# Altium schematic sheet PWR612A_SH2.SchDoc: TPS23861 Base Board without  VPWR
size 558 x 431 mm; Engineer: Trevor; Revision: A; Name: Trevor
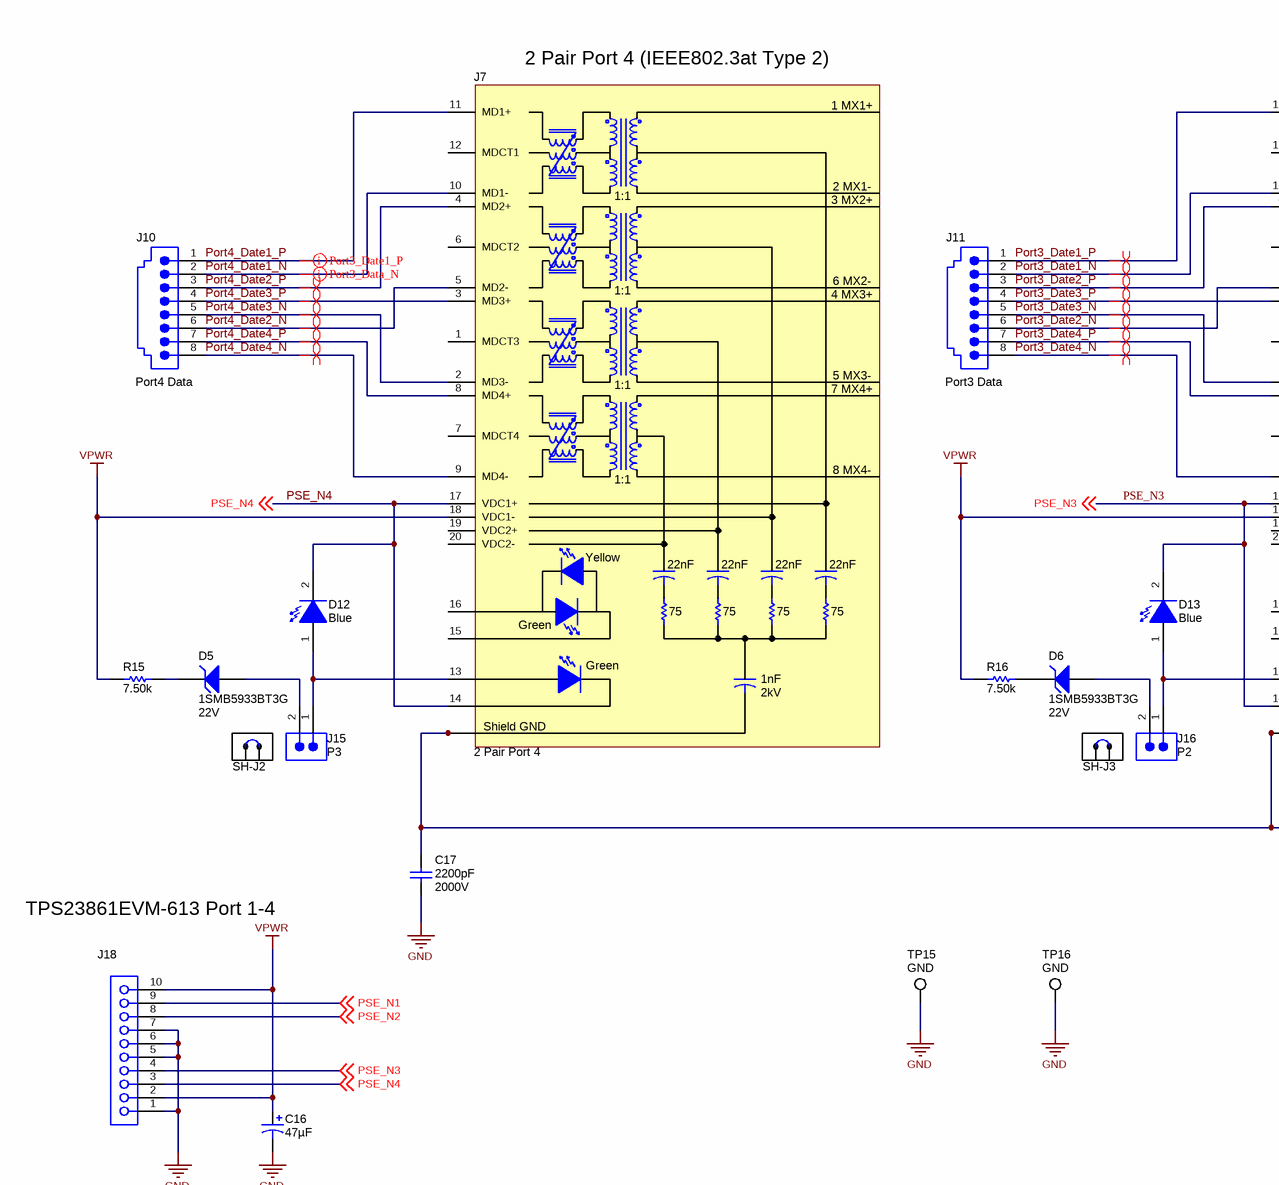
[diagram p0: PWR612A_SH2.SchDoc, top left]
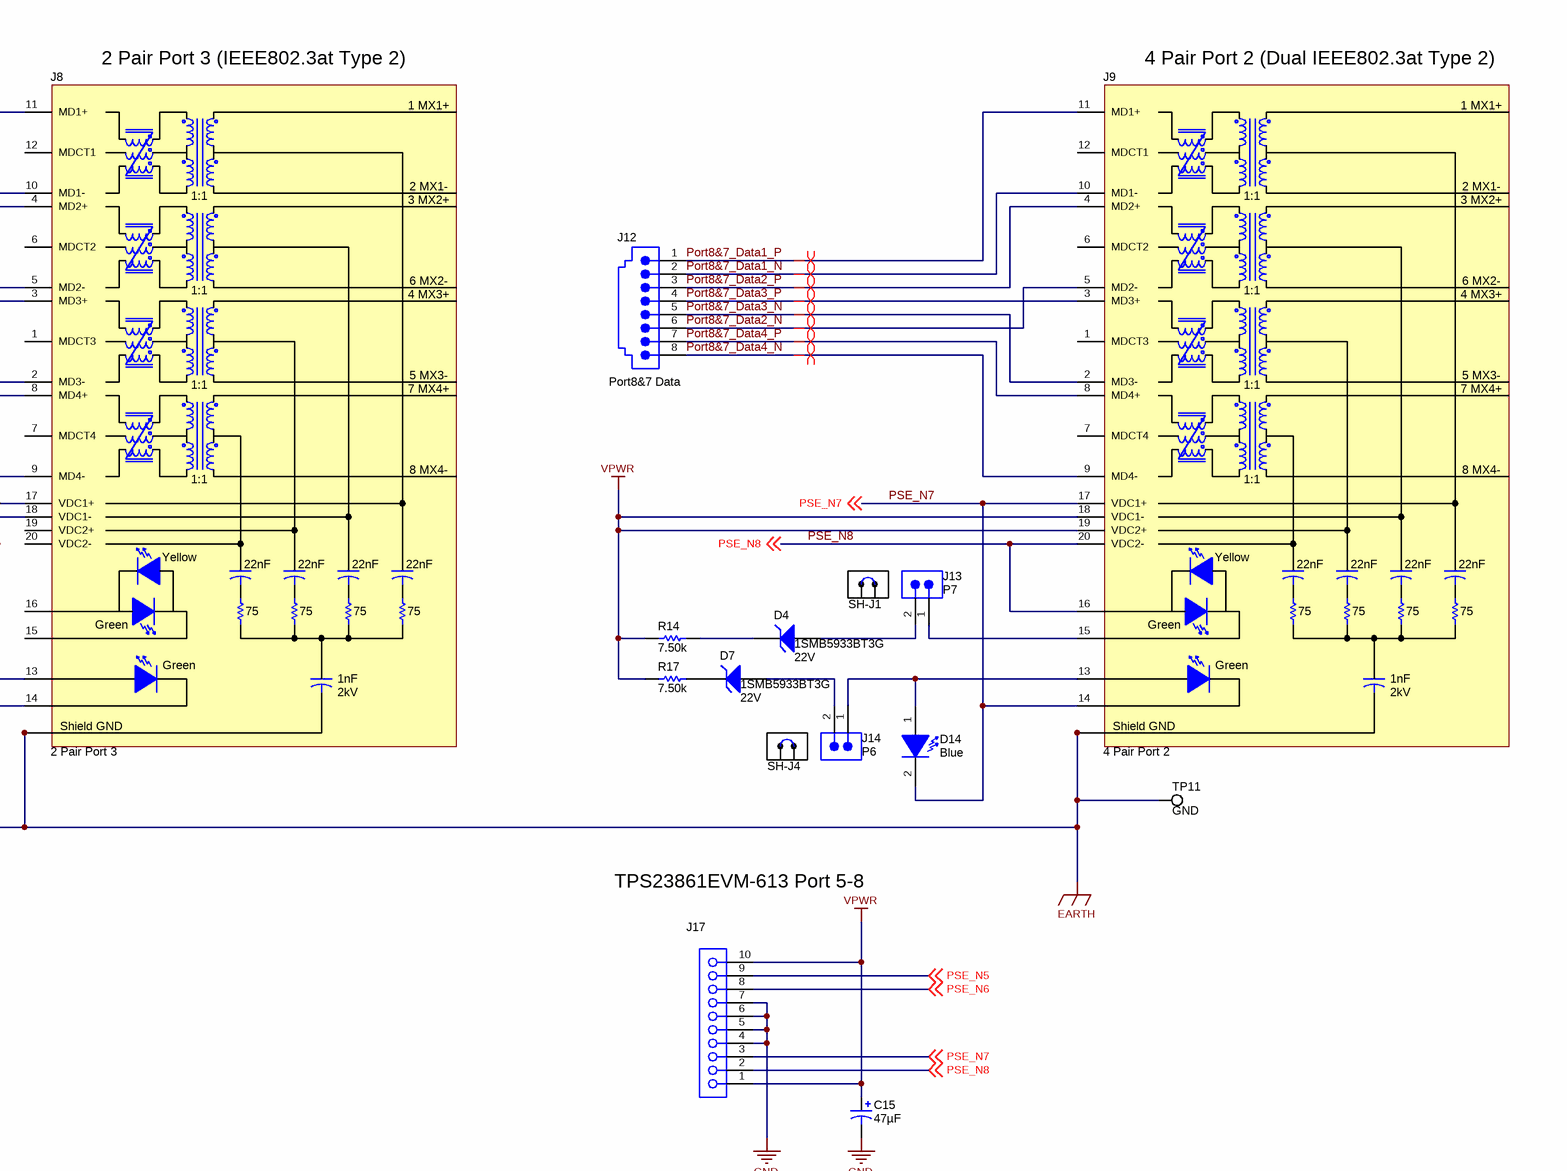
[diagram p1: PWR612A_SH2.SchDoc, top right]
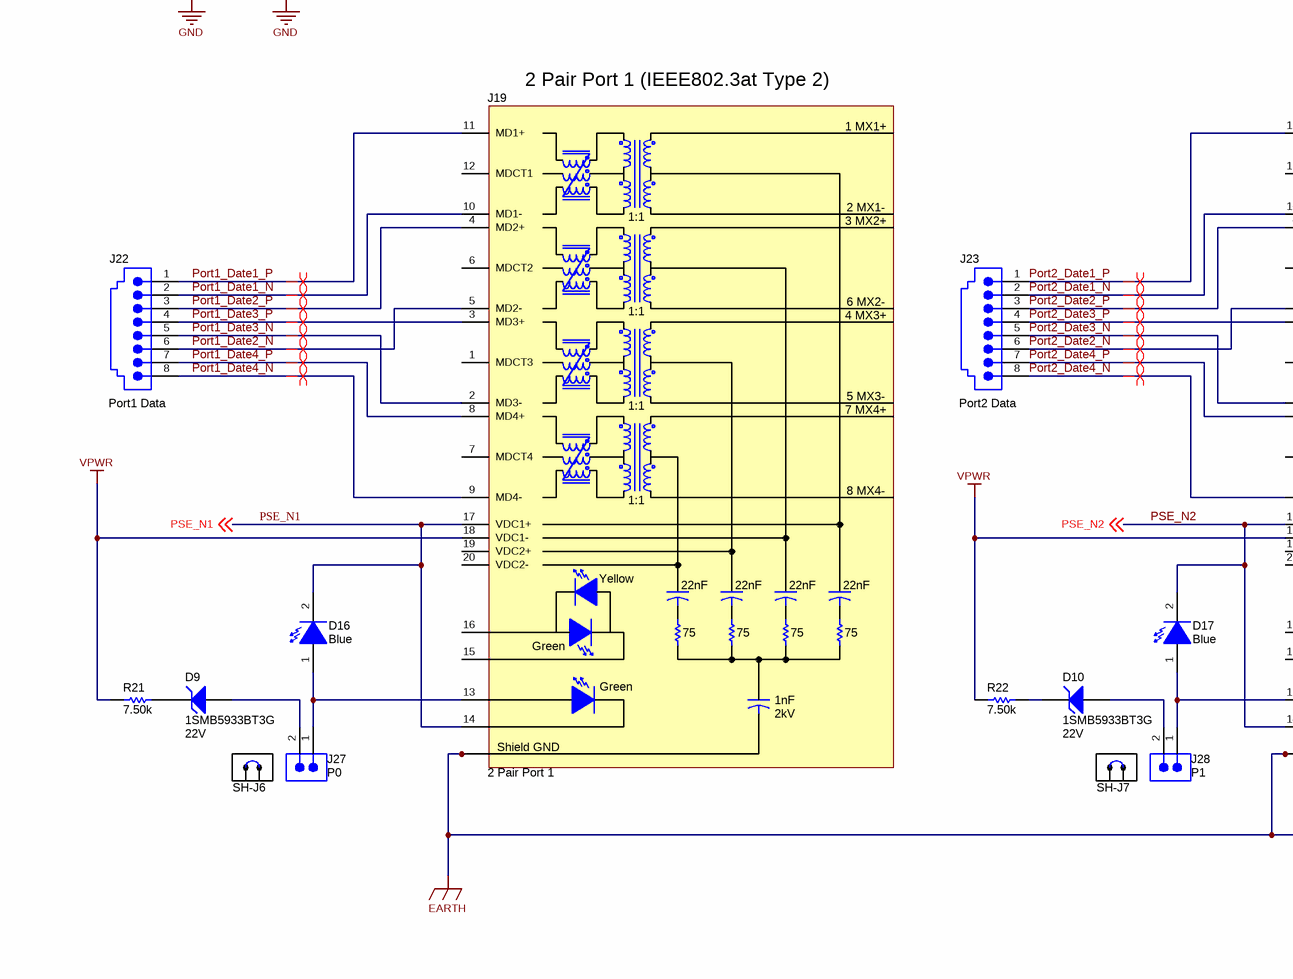
[diagram p2: PWR612A_SH2.SchDoc, bottom left]
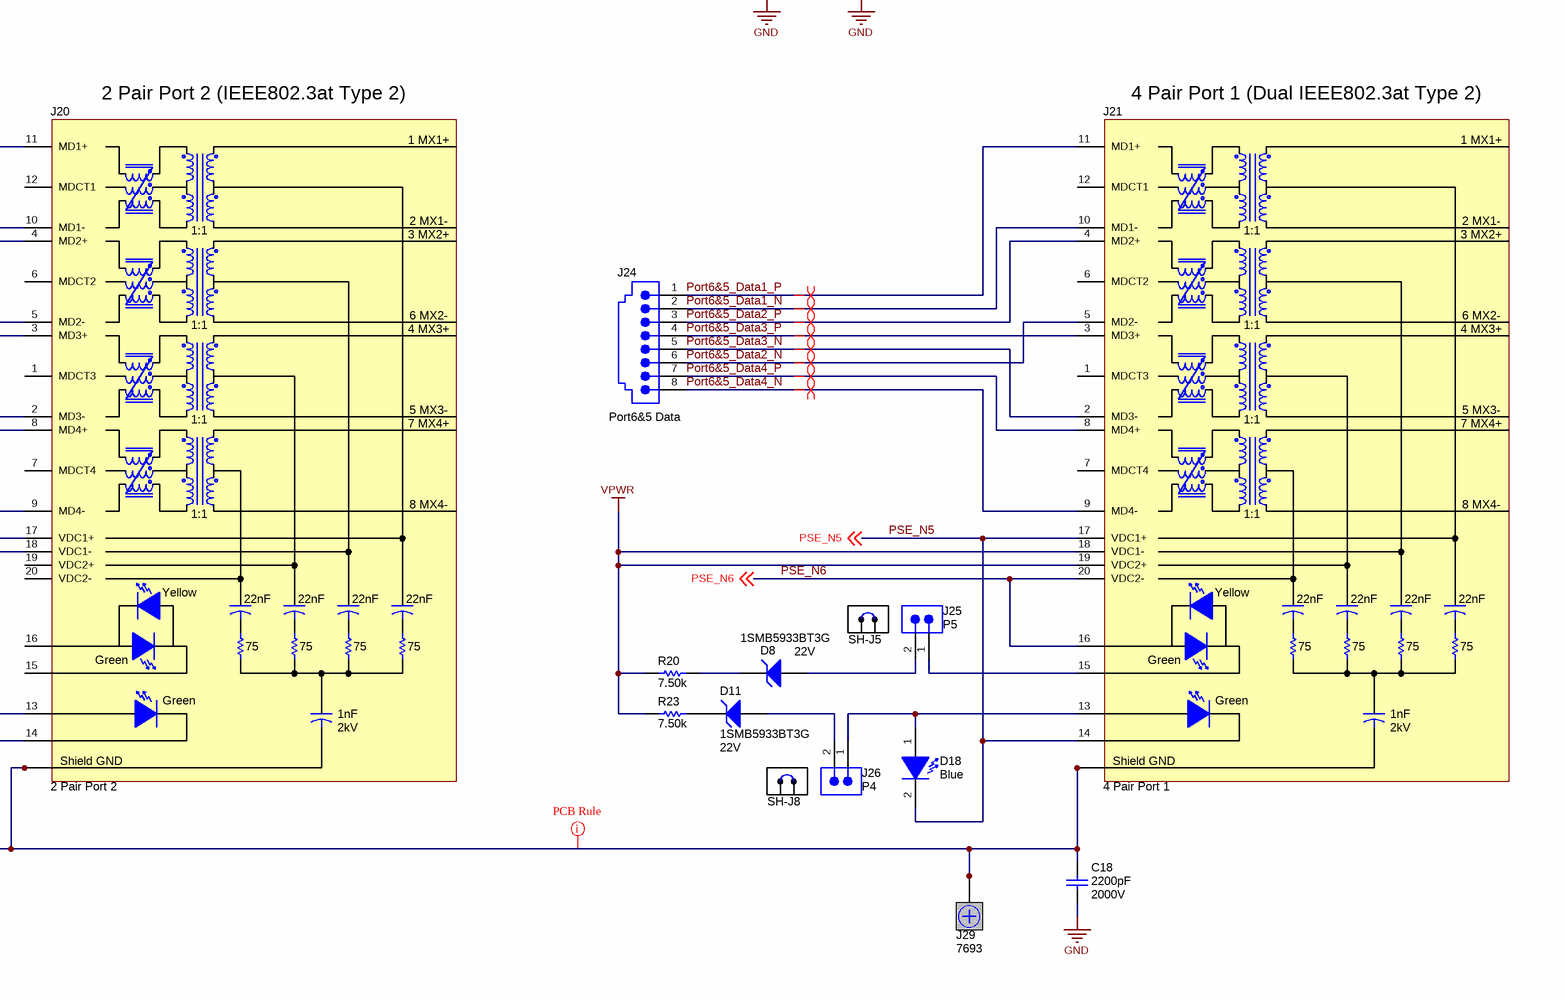
[diagram p3: PWR612A_SH2.SchDoc, bottom right]

## Parts
C15  ValueDisplayed: 47µF  [SM_RADIAL_H13]  (hidden comment: EEV-FK2A470Q)
C16  ValueDisplayed: 47µF  [SM_RADIAL_H13]  (hidden comment: EEV-FK2A470Q)
C17  ValueDisplayed: 2200pF  Value2: 2000V  [1812]  (hidden comment: C4532X7R3D222K)
C18  ValueDisplayed: 2200pF  Value2: 2000V  [1812]  (hidden comment: C4532X7R3D222K)
D4  1SMB5933BT3G  value 22V  [SMB]
D5  1SMB5933BT3G  value 22V  [SMB]
D6  1SMB5933BT3G  value 22V  [SMB]
D7  1SMB5933BT3G  value 22V  [SMB]
D8  1SMB5933BT3G  value 22V  [SMB]
D9  1SMB5933BT3G  value 22V  [SMB]
D10  1SMB5933BT3G  value 22V  [SMB]
D11  1SMB5933BT3G  value 22V  [SMB]
D12  value Blue  [LB Q39G_BLUE]  (hidden comment: LB Q39G-L2N2-35-1)
D13  value Blue  [LB Q39G_BLUE]  (hidden comment: LB Q39G-L2N2-35-1)
D14  value Blue  [LB Q39G_BLUE]  (hidden comment: LB Q39G-L2N2-35-1)
D16  value Blue  [LB Q39G_BLUE]  (hidden comment: LB Q39G-L2N2-35-1)
D17  value Blue  [LB Q39G_BLUE]  (hidden comment: LB Q39G-L2N2-35-1)
D18  value Blue  [LB Q39G_BLUE]  (hidden comment: LB Q39G-L2N2-35-1)
J7  2 Pair Port 4  [JK0-0177NL]
J8  2 Pair Port 3  [JK0-0177NL]
J9  4 Pair Port 2  [JK0-0177NL]
J10  SS-7188V-A-NF  [CONN_SS-7188V-A-NF]  (value not drawn)
J11  SS-7188V-A-NF  [CONN_SS-7188V-A-NF]  (value not drawn)
J12  SS-7188V-A-NF  [CONN_SS-7188V-A-NF]  (value not drawn)
J13  P7  [TSW-102-07-G-S]
J14  P6  [TSW-102-07-G-S]
J15  P3  [TSW-102-07-G-S]
J16  P2  [TSW-102-07-G-S]
J17  Port8&7&6&5  [CONN_SSW-110-23-F-S]  (value not drawn)
J18  Port4&3&2&1  [CONN_SSW-110-23-F-S]  (value not drawn)
J19  2 Pair Port 1  [JK0-0177NL]
J20  2 Pair Port 2  [JK0-0177NL]
J21  4 Pair Port 1  [JK0-0177NL]
J22  SS-7188V-A-NF  [CONN_SS-7188V-A-NF]  (value not drawn)
J23  SS-7188V-A-NF  [CONN_SS-7188V-A-NF]  (value not drawn)
J24  SS-7188V-A-NF  [CONN_SS-7188V-A-NF]  (value not drawn)
J25  P5  [TSW-102-07-G-S]
J26  P4  [TSW-102-07-G-S]
J27  P0  [TSW-102-07-G-S]
J28  P1  [TSW-102-07-G-S]
J29  7693  [7693]
R14  value 7.50k  [1206]  (hidden comment: CRCW12067K50FKEA)
R15  value 7.50k  [1206]  (hidden comment: CRCW12067K50FKEA)
R16  value 7.50k  [1206]  (hidden comment: CRCW12067K50FKEA)
R17  value 7.50k  [1206]  (hidden comment: CRCW12067K50FKEA)
R20  value 7.50k  [1206]  (hidden comment: CRCW12067K50FKEA)
R21  value 7.50k  [1206]  (hidden comment: CRCW12067K50FKEA)
R22  value 7.50k  [1206]  (hidden comment: CRCW12067K50FKEA)
R23  value 7.50k  [1206]  (hidden comment: CRCW12067K50FKEA)
SH-J1  SPC02SYAN  [SPC02SYAN]  (value not drawn)
SH-J2  SPC02SYAN  [SPC02SYAN]  (value not drawn)
SH-J3  SPC02SYAN  [SPC02SYAN]  (value not drawn)
SH-J4  SPC02SYAN  [SPC02SYAN]  (value not drawn)
SH-J5  SPC02SYAN  [SPC02SYAN]  (value not drawn)
SH-J6  SPC02SYAN  [SPC02SYAN]  (value not drawn)
SH-J7  SPC02SYAN  [SPC02SYAN]  (value not drawn)
SH-J8  SPC02SYAN  [SPC02SYAN]  (value not drawn)
TP11  GND  [Testpoint_Keystone_Compact]
TP15  GND  [Testpoint_Keystone_Compact]
TP16  GND  [Testpoint_Keystone_Compact]

## Nets
EARTH: C17.1 C18.1 J7.21(Shield) J7.22(Shield) J8.21(Shield) J8.22(Shield) J9.21(Shield) J9.22(Shield) J19.21(Shield) J19.22(Shield) J20.21(Shield) J20.22(Shield) J21.21(Shield) J21.22(Shield) J29.1 J29.2 J29.3 J29.4 TP11.1
GND: C15.2(-) C16.2(-) C17.2 C18.2 J17.4 J17.5 J17.6 J17.7 J18.1 J18.5 J18.6 J18.7 TP15.1 TP16.1
VPWR: C15.1(+) C16.1(+) J7.18(VDC1-) J8.18(VDC1-) J9.18(VDC1-) J9.19(VDC2+) J17.1 J17.10 J18.2 J18.10 J19.18(VDC1-) J20.18(VDC1-) J21.18(VDC1-) J21.19(VDC2+) R14.1 R15.1 R16.1 R17.1 R20.1 R21.1 R22.1 R23.1
Port1_Date1_N: J19.10(MD1-) J22.2
Port1_Date1_P: J19.11(MD1+) J22.1
Port1_Date2_N: J19.5(MD2-) J22.6
Port1_Date2_P: J19.4(MD2+) J22.3
Port1_Date3_N: J19.2(MD3-) J22.5
Port1_Date3_P: J19.3(MD3+) J22.4
Port1_Date4_N: J19.9(MD4-) J22.8
Port1_Date4_P: J19.8(MD4+) J22.7
Port2_Date1_N: J20.10(MD1-) J23.2
Port2_Date1_P: J20.11(MD1+) J23.1
Port2_Date2_N: J20.5(MD2-) J23.6
Port2_Date2_P: J20.4(MD2+) J23.3
Port2_Date3_N: J20.2(MD3-) J23.5
Port2_Date3_P: J20.3(MD3+) J23.4
Port2_Date4_N: J20.9(MD4-) J23.8
Port2_Date4_P: J20.8(MD4+) J23.7
Port3_Date1_N: J8.10(MD1-) J11.2
Port3_Date1_P: J8.11(MD1+) J11.1
Port3_Date2_N: J8.5(MD2-) J11.6
Port3_Date2_P: J8.4(MD2+) J11.3
Port3_Date3_N: J8.2(MD3-) J11.5
Port3_Date3_P: J8.3(MD3+) J11.4
Port3_Date4_N: J8.9(MD4-) J11.8
Port3_Date4_P: J8.8(MD4+) J11.7
Port4_Date1_N: J7.10(MD1-) J10.2
Port4_Date1_P: J7.11(MD1+) J10.1
Port4_Date2_N: J7.5(MD2-) J10.6
Port4_Date2_P: J7.4(MD2+) J10.3
Port4_Date3_N: J7.2(MD3-) J10.5
Port4_Date3_P: J7.3(MD3+) J10.4
Port4_Date4_N: J7.9(MD4-) J10.8
Port4_Date4_P: J7.8(MD4+) J10.7
Port6&5_Data1_N: J21.10(MD1-) J24.2
Port6&5_Data1_P: J21.11(MD1+) J24.1
Port6&5_Data2_N: J21.5(MD2-) J24.6
Port6&5_Data2_P: J21.4(MD2+) J24.3
Port6&5_Data3_N: J21.2(MD3-) J24.5
Port6&5_Data3_P: J21.3(MD3+) J24.4
Port6&5_Data4_N: J21.9(MD4-) J24.8
Port6&5_Data4_P: J21.8(MD4+) J24.7
Port8&7_Data1_N: J9.10(MD1-) J12.2
Port8&7_Data1_P: J9.11(MD1+) J12.1
Port8&7_Data2_N: J9.5(MD2-) J12.6
Port8&7_Data2_P: J9.4(MD2+) J12.3
Port8&7_Data3_N: J9.2(MD3-) J12.5
Port8&7_Data3_P: J9.3(MD3+) J12.4
Port8&7_Data4_N: J9.9(MD4-) J12.8
Port8&7_Data4_P: J9.8(MD4+) J12.7
PSE_N1: D16.2(K) J18.9 J19.14 J19.17(VDC1+) ; off-sheet PSE_N1
PSE_N2: D17.2(K) J18.8 J20.14 J20.17(VDC1+) ; off-sheet PSE_N2
PSE_N3: D13.2(K) J8.14 J8.17(VDC1+) J18.4 ; off-sheet PSE_N3
PSE_N4: D12.2(K) J7.14 J7.17(VDC1+) J18.3 ; off-sheet PSE_N4
PSE_N5: D18.2(K) J17.9 J21.14 J21.17(VDC1+) ; off-sheet PSE_N5
PSE_N6: J17.8 J21.16 J21.20(VDC2-) ; off-sheet PSE_N6
PSE_N7: D14.2(K) J9.14 J9.17(VDC1+) J17.3 ; off-sheet PSE_N7
PSE_N8: J9.16 J9.20(VDC2-) J17.2 ; off-sheet PSE_N8
NetD4_1: D4.1(K) R14.2
NetD4_2: D4.2(A) J13.2
NetD5_1: D5.1(K) R15.2
NetD5_2: D5.2(A) J15.2
NetD6_1: D6.1(K) R16.2
NetD6_2: D6.2(A) J16.2
NetD7_1: D7.1(K) R17.2
NetD7_2: D7.2(A) J14.2
NetD8_1: D8.1(K) R20.2
NetD8_2: D8.2(A) J25.2
NetD9_1: D9.1(K) R21.2
NetD9_2: D9.2(A) J27.2
NetD10_1: D10.1(K) R22.2
NetD10_2: D10.2(A) J28.2
NetD11_1: D11.1(K) R23.2
NetD11_2: D11.2(A) J26.2
NetD12_1: D12.1(A) J7.13 J15.1
NetD13_1: D13.1(A) J8.13 J16.1
NetD14_1: D14.1(A) J9.13 J14.1
NetD16_1: D16.1(A) J19.13 J27.1
NetD17_1: D17.1(A) J20.13 J28.1
NetD18_1: D18.1(A) J21.13 J26.1
NetJ9_15: J9.15 J13.1
NetJ21_15: J21.15 J25.1

Not connected (* = marked no-connect by the designer): J7 1(MDCT3) 6(MDCT2) 7(MDCT4) 12(MDCT1) 15 16 19(VDC2+) 20(VDC2-); J8 1(MDCT3) 6(MDCT2) 7(MDCT4) 12(MDCT1) 15 16 19(VDC2+) 20(VDC2-); J9 1(MDCT3) 6(MDCT2) 7(MDCT4) 12(MDCT1); J19 1(MDCT3) 6(MDCT2) 7(MDCT4) 12(MDCT1) 15 16 19(VDC2+) 20(VDC2-); J20 1(MDCT3) 6(MDCT2) 7(MDCT4) 12(MDCT1) 15 16 19(VDC2+) 20(VDC2-); J21 1(MDCT3) 6(MDCT2) 7(MDCT4) 12(MDCT1)

## Layout directives
differential pair: Port1_Date1_N, Port1_Date1_P, Port1_Date2_N, Port1_Date2_P, Port1_Date3_N, Port1_Date3_P, Port1_Date4_N, Port1_Date4_P, Port2_Date1_N, Port2_Date1_P, Port2_Date2_N, Port2_Date2_P, Port2_Date3_N, Port2_Date3_P, Port2_Date4_N, Port2_Date4_P, Port3_Date1_N, Port3_Date1_P, Port3_Date2_N, Port3_Date2_P, Port3_Date3_N, Port3_Date3_P, Port3_Date4_N, Port3_Date4_P, Port4_Date1_N, Port4_Date1_P, Port4_Date2_N, Port4_Date2_P, Port4_Date3_N, Port4_Date3_P, Port4_Date4_N, Port4_Date4_P, Port6&5_Data1_N, Port6&5_Data1_P, Port6&5_Data2_N, Port6&5_Data2_P, Port6&5_Data3_N, Port6&5_Data3_P, Port6&5_Data4_N, Port6&5_Data4_P, Port8&7_Data1_N, Port8&7_Data1_P, Port8&7_Data2_N, Port8&7_Data2_P, Port8&7_Data3_N, Port8&7_Data3_P, Port8&7_Data4_N, Port8&7_Data4_P
rule Undefined; rule Clearance Constraint [Clearance = 39mil]: EARTH

## Notes on the sheet
- 2 Pair Port 4 (IEEE802.3at Type 2)
- 2 Pair Port 3 (IEEE802.3at Type 2)
- (near J9) 4 Pair Port 2 (Dual IEEE802.3at Type 2)
- (near J10) Port4 Data
- (near J11) Port3 Data
- (near J12) Port8&7 Data
- TPS23861EVM-613 Port 1-4
- TPS23861EVM-613 Port 5-8
- (near J19) 2 Pair Port 1 (IEEE802.3at Type 2)
- 2 Pair Port 2 (IEEE802.3at Type 2)
- (near J21) 4 Pair Port 1 (Dual IEEE802.3at Type 2)
- (near J22) Port1 Data
- (near J23) Port2 Data
- (near J24) Port6&5 Data
- Drawn By:
- SVN Rev:
- Number:
- Rev:
- Sheet Title:
- File:
- Project Title:
- Designed for:
- Assembly Variant:
- Mod. Date:
- Sheet:
- Size:
- of
- C
- http://www.ti.com
- Texas Instruments and/or its licensors do not warrant the accuracy or completeness of this specification or any information contained therein. Texas Instruments and/or its licensors do not warrant that this design will meet the specifications, will be suitable for your application or fit for any particular purpose, or will operate in an implementation. Texas Instruments and/or its licensors do not warrant that the design is production worthy. You should completely validate and test your design implementation to confirm the system functionality for your application.
- Engineer:
- Contact:
- © Texas Instruments
- (in symbol JK0-0177NL) 1 MX1+; 2 MX1-; 1:1; 3 MX2+; 6 MX2-; 4 MX3+; 5 MX3-; 7 MX4+; 8 MX4-; Yellow; 22nF; 75; Green; 1nF; 2kV; Shield GND

## Library data of the parts
C15 C16 = EEV-FK2A470Q: CAP, AL, 47uF, 100V, +/-20%, 0.32 ohm, SMD; Manufacturer: Panasonic; Polarized: Y; CompType: Capacitor; U/M: EA; Cap_F: 0.000047; Tolerance_%: 20; VDC_V: 100; ESR_Ohm: 0.32; IRMS_A: 0.5; TaMin_C: -55; TaMax_C: 105; Cap_Case: H13; SymbolVersion: 2008-07-09; Value: 47uF; PartNumber: EEV-FK2A470Q; PackageReference: SMT Radial H13; RoHS: Y; Value1: 0.32 ohm; Value2: 100V; MountType: SMT; Technology: AL; Series: FK; Publisher: Texas Instruments; LatestRevisionDate: 2013-05-15; ComponentLink1Description: Datasheet link; ComponentLink1URL: http://www.panasonic.com/industrial/components/pdf/smt_aec_050505.pdf; Supplier 1: Digi-Key; Supplier Part Number 1: PCE3497CT-ND; Supplier 2: Mouser; Supplier Part Number 2: 667-EEV-FK2A470Q; Supplier 3: Farnell; Supplier Part Number 3: 9696148
C17 C18 = C4532X7R3D222K: CAP, CERM, 2200pF, 2000V, +/-10%, X7R, 1812; Manufacturer: TDK; Polarized: N; CompType: Capacitor; U/M: EA; Cap_F: 0.0000000022; Tolerance_%: 10; Value1: Unknown; VDC_V: 2000; TaMin_C: -55; TaMax_C: 125; SymbolVersion: 2008-07-09; Value: 2200pF; PartNumber: C4532X7R3D222K; PackageReference: 1812; RoHS: Y; MountType: SMT; Technology: Ceramic; TempCo: X7R; Cap_Case: 1812; Published: 2008-06-19; Publisher: Texas Instruments; LatestRevisionDate: 2014-01-24; ComponentLink1Description: Datasheet link; ComponentLink1URL: http://www.tdk.co.jp/tefe02/e4142_c.pdf; Supplier 1: Digi-Key; Supplier Part Number 1: 445-2389-1-ND; Supplier 2: Farnell; Supplier Part Number 2: 1844458
D4-D11 = 1SMB5933BT3G: Diode, Zener, 22V, 550mW, SMB; Manufacturer: ON Semiconductor; U/M: EA; Power_W: 0.55; Vz_V: 22; Value1: 0.55W; RJA_CperW: 226; CompType: Zener; SymbolVersion: 2010-08-25; PartNumber: 1SMB5933BT3G; PackageReference: SMB; Vr_V: N/A; MountType: SMT; RoHS: Y; ComponentLink1Description: Datasheet link; ComponentLink1URL: http://www.onsemi.com/pub_link/Collateral/1SMB5913BT3-D.PDF; Published: 2008-10-08; Publisher: Texas Instruments; LatestRevisionDate: 2013-04-19; LatestRevisionNote: Updated Supplier Data; Supplier 1: Mouser; Supplier Part Number 1: 863-1SMB5933BT3G; Supplier 2: Farnell; Supplier Part Number 2: 1431175; Supplier 3: Newark; Supplier Part Number 3: 42K3098
D12-D14 D16-D18 = LB Q39G-L2N2-35-1: LED, Blue, SMD; Manufacturer: OSRAM; Vf_V: 2.85; Value2: 2.85V; Io_A: 0.15; Tjmax_C: 95; Value1: W; U/M: EA; CompType: LED; PartNumber: LB Q39G-L2N2-35-1; SymbolVersion: 2008-12-08; MountType: SMT; RoHS: Y; PackageReference: BLUE 0603 LED; Type: ?; Color: blue; Published: 2008-07-11; Publisher: Texas Instruments; ComponentLink1URL: http://catalog.osram-os.com/catalogue/catalogue.do;jsessionid=8F4D5D14036503CDC6D844D9AC77EBC1?act=downloadFile&favOid=02000006000372cb000100b6; ComponentLink1Description: Datasheet link; LatestRevisionDate: 2014-01-14; Supplier 1: Digi-Key; Supplier Part Number 1: 475-2816-1-ND; Supplier 2: Mouser; Supplier Part Number 2: 720-LBQ39GL2N2351
J7-J9 J19-J21 = JK0-0177NL: RJ-45 with integrated magnetics; Manufacturer: Pulse Engineering; Alternate Manufacturer: Wurth Elektronik; Alternate PartNumber: 7499511611 or 7499511611A; SymbolCreator: x0208325; CompType: Connector; U/M: EA; SymbolVersion: 2014-01-06; MountType: TH; RoHS: Y; PartNumber: JK0-0177NL; PackageReference: RJ-45 Jack; ComponentLink1Description: Datasheet Link; ComponentLink1URL: http://productfinder.pulseeng.com/products/datasheets/J432.pdf;jsessionid=61CA675B3E12EE14335C6EF38D996E84; Publisher: Texas Instruments; LatestRevisionDate: 2014-01-16; Supplier 1: Digi-Key; Supplier Part Number 1: JK0-0177NL-ND; Supplier 2: Mouser; Supplier Part Number 2: 673-JK0-0177NL
J10-J12 J22-J24 = SS-7188V-A-NF: RJ-45, Vertical, TH; Manufacturer: Stewart Connector; SymbolCreator: a0799628; CompType: Connector; U/M: EA; SymbolVersion: 2013-05-15; PartNumber: SS-7188V-A-NF; RoHS: Y; PackageReference: RJ-45 Jack, 8Pos Right Angle; MountType: TH; ComponentLink1Description: Datasheet Link; ComponentLink1URL: http://belfuse.com/pdfs/CT710021.pdf; Publisher: Texas Instruments; LatestRevisionDate: 2013-07-11; Supplier 1: Digi-Key; Supplier Part Number 1: 380-1050-ND
J13-J16 J25-J28 = TSW-102-07-G-S: Header, TH, 100mil, 2x1, Gold plated, 230 mil above insulator; Manufacturer: Samtec, Inc.; SymbolCreator: a0412235; U/M: EA; SymbolVersion: 2013-03-14; PartNumber: TSW-102-07-G-S; ClassName: Header; CompType: Header; RoHS: Y; PackageReference: TSW-102-07-G-S; MountType: TH; ComponentLink1Description: Datasheet Link; ComponentLink1URL: http://samtec.com/ftppub/pdf/TSW_TH.PDF; Publisher: Texas Instruments; LatestRevisionDate: 2013-04-15; Supplier 1: Digi-Key; Supplier Part Number 1: SAM1029-02-ND
J17 J18 = SSW-110-23-F-S: Connector, Receptacle, 100mil, 10x1, Gold plated, TH; PartNumber: SSW-110-01-G-S; Manufacturer: Samtec, Inc.; SymbolCreator: a0411947; U/M: EA; SymbolVersion: 2013-01-28; CompType: Connector; RoHS: Y; PackageReference: HEADER, RECEPTACLE, 100mil, 10x1; MountType: TH; ComponentLink1Description: Datasheet Link; ComponentLink1URL: http://www.samtec.com/technical-specifications/default.aspx?SeriesMaster=SSW; Publisher: Texas Instruments; LatestRevisionDate: 2013-04-26; Supplier 1: Digi-Key; Supplier Part Number 1: SAM1209-10-ND
J29 = 7693: Terminal screw, vertical, snap-in; Manufacturer: Keystone; SymbolCreator: a0412235; Value: 15A; CompType: Screw Terminal; U/M: EA; SymbolVersion: 2009-04-07; PartNumber: 7693; PackageReference: 7693; RoHS: Y; MountType: TH; ComponentLink1Description: Datasheet Link; ComponentLink1URL: http://www.keyelco.com/pdfs/M55-prod19.pdf; Publisher: Texas Instruments; LatestRevisionDate: 2013-12-17; Supplier 1: Digi-Key; Supplier Part Number 1: 7693K-ND
R14-R17 R20-R23 = CRCW12067K50FKEA: RES, 7.50k ohm, 1%, 0.25W, 1206; Manufacturer: Vishay-Dale; CompType: Resistor; Res_ohm: 7500; Value_Code: 7k50; Tolerance_%: 1; Power_W: 0.25; VDC_V: 200; TempCo: 100 ppm/C; EIA_Code: E96; U/M: EA; SymbolVersion: 2009-05-29; PartNumber: CRCW12067K50FKEA; PackageReference: 1206; RoHS: Y; Value1: 1%; Value2: 0.25W; MountType: SMT; Technology: Thick Film; Published: 2008-06-26; Publisher: Texas Instruments; LatestRevisionDate: 2013-07-11; ComponentLink1Description: Datasheet link; ComponentLink1URL: http://www.vishay.com/docs/20035/dcrcwe3.pdf; Supplier 1: Digi-Key; Supplier Part Number 1: 541-7.50KFCT-ND; Supplier 2: Mouser; Supplier Part Number 2: 71-CRCW1206-7.5K-E3; Supplier 3: Farnell; Supplier Part Number 3: 1653170
SH-J1-SH-J8 = SPC02SYAN: Shunt, 100mil, Flash Gold, Black; Manufacturer: Sullins Connector Solutions; Value: 1x2; Note: You can "mate" this to a header by matching the designator.  i.e. use SH-J3 for header J3; ClassName: Shunt; CompType: Shunt; PartNumber: SPC02SYAN; RoHS: Y; PackageReference: Closed Top 100mil Shunt; MountType: N/A; ComponentLink1Description: Datasheet Link; ComponentLink1URL: http://www.sullinscorp.com/drawings/134_C02SYAN_11134.pdf; Publisher: Texas Instruments; LatestRevisionDate: 2013-09-03; Supplier 1: Digi-Key; Supplier Part Number 1: S9001-ND
TP11 TP15 TP16 = 5016: Test Point, Compact, SMT; Manufacturer: Keystone; CompType: Test Point Loop; U/M: EA; SymbolVersion: 2008-04-04; PartNumber: 5016; Value: SMT; RoHS: Y; PackageReference: Testpoint_Keystone_Compact; MountType: SMT; ComponentLink1Description: Datasheet Link; ComponentLink1URL: http://www.keyelco.com/userAssets/store/files/5016.PDF; Publisher: Texas Instruments; LatestRevisionDate: 2013-05-17; Supplier 1: Digi-Key; Supplier Part Number 1: 5016KCT-ND; NetName: GND